# EAGLE schematic Doormio (EAGLE 8.4.0)
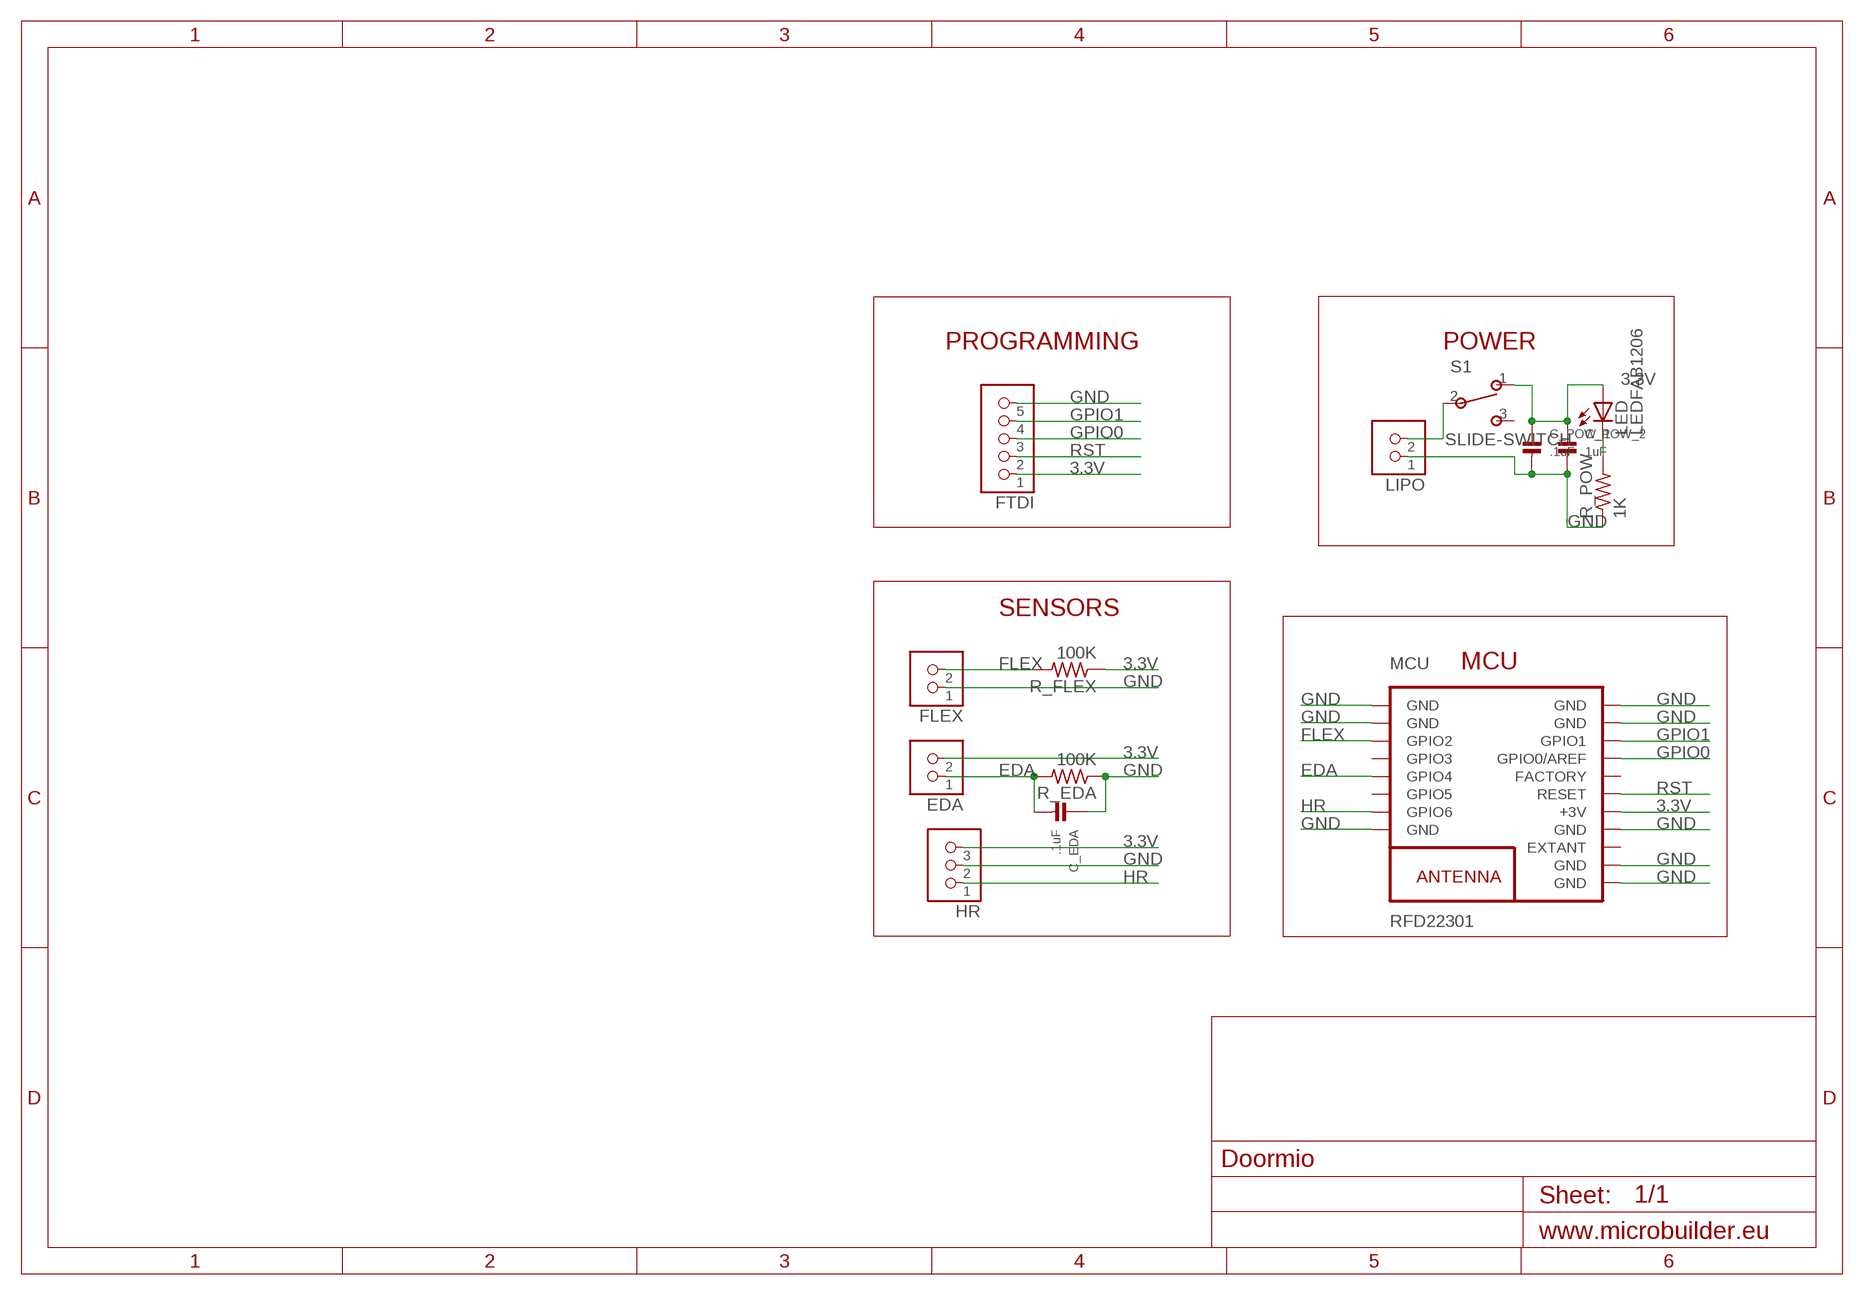
[diagram p0: schematic, sheet 1]

## Parts
C_EDA  .1uF  CAP_CERAMIC0603  [0603]
C_POW_1  .1uF  CAP_CERAMIC0603  [0603]
C_POW_2  1uF  CAP_CERAMIC0603  [0603]
EDA  1X2-SMD-HEADER  [1X02SMD]
FLEX  1X2-SMD-HEADER  [1X02SMD]
FTDI  1X5-SMD-HEADER  [1X05SMD]
HR  1X3-SMD-HEADER  [1X03SMD]
LED  LEDFAB1206  [LED1206FAB]
LIPO  1X2-SMD-HEADER  [1X02SMD]
MCU  RFD22301  [RFD22301]
R_EDA  100K  R-US_R0603  [R0603]
R_FLEX  100K  R-US_R0603  [R0603]
R_POW  1K  R-US_R0603  [R0603]
S1  SLIDE-SWITCH  [AYZ0102AGRLC]

## Nets
3.3V: C_POW_1.1 C_POW_2.1 EDA.VCC FTDI.1 HR.3 LED.1(A) MCU.13(+3V) R_FLEX.1 S1.1
EDA: C_EDA.2 EDA.GND MCU.5(GPIO4) R_EDA.2
FLEX: FLEX.VCC MCU.3(GPIO2) R_FLEX.2
GND: C_EDA.1 C_POW_1.2 C_POW_2.2 FLEX.GND FTDI.5 HR.2 LIPO.GND MCU.1(GND) MCU.2(GND) MCU.8(GND) MCU.9(GND) MCU.10(GND) MCU.12(GND) MCU.18(GND) MCU.19(GND) R_EDA.1 R_POW.1
GPIO0: FTDI.3 MCU.16(GPIO0/AREF)
GPIO1: FTDI.4 MCU.17(GPIO1)
HR: HR.1 MCU.7(GPIO6)
LED_RES: LED.2(C) R_POW.2
RST: FTDI.2 MCU.14(RESET)
VIN: LIPO.VCC S1.2
Unconnected: MCU.4(GPIO3) MCU.6(GPIO5) MCU.11(EXTANT) MCU.15(FACTORY) S1.3

## Notes on the sheet
- PROGRAMMING | POWER
- SENSORS
- MCU

## Library data of the parts
C_EDA C_POW_1 C_POW_2 = microbuilder:CAP_CERAMIC: Ceramic Capacitors 0402 - 0402 Surface Mount Capacitors 16pF 50V 5% [Digikey: 445-4899-2-ND] 18pF 50V 5% [Digikey: 490-1281-2-ND] 22pF 50V 5% [Digikey: 490-1283-2-ND] 68pF 50V 5% [Digikey: 490-1289-2-ND] 0.1uF 10V 10% [Digikey: 490-1318-2-ND] 1.0uF 6.3V 10% [Digikey: 490-1320-2-ND] 0603 - 0603 Surface Mount Capacitors 16 pF 50V 5% [Digikey: 445-5051-2-ND] 22 pF 50V [Digikey: PCC220ACVTR-ND] 33 pF 50V 5% [Digikey: 490-1415-1-ND] 56pF 50V 5% [Digikey: 490-1421-1-ND] 220pF 50V 5% [Digikey: 445-1285-1-ND] 680 pF 50V 2200 pF 50V 5% C0G [Digikey: 445-1297-1-ND] 5600 pF 100V 5% X7R [Digikey: 478-3711-1-ND] 0.1 µF 25V 10% [Digikey: PCC2277TR-ND] 0.22 µF 16V 10% X7R [Digikey: 445-1318-1-ND] 1.0 µF 25V 10% [Digikey: 445-5146-2-ND] 0603 - RF Specific 3pF 250V +/-0.1pF RF [Digikey: 712-1347-1-ND] 18 pF 250V 5% [Digikey: 478-3505-1-ND or 712-1322-1-ND] 56 pF 250V 5% C0G RF [Digikey: 490-4867-1-ND] 68 pF 250V RF [Digikey: 490-4868-1-ND] 0805 - 0805 Surface Mount Capacitors 220 pF 250V 2% RF Ceramic Capacitor [Digikey: 712-1398-1-ND] 1000 pF 50V 2% NP0 Ceramic Capacitor [Digikey: 478-3760-1-ND] 0.1 µF 25V 10% Ceramic Capacitor [Digikey: PCC1828TR-ND] 1.0 µF 16V 10% Ceramic Capacitor[Digikey: 490-1691-2-ND] 10.0 µF 10V 10% Ceramic Capacitor[Digikey: 709-1228-1-ND] 10.0 uF 16V 10% Ceramic Capacitor [Digikey: 478-5165-2-ND] 47 uF 6.3V 20% Ceramic Capacitor [Digikey: 587-1779-1-ND or 399-5506-1-ND] 1206 - 1206 Surface Mount Capacitors 47uF 10V 20% Ceramic Capacitor [Digikey: 490-5528-1-ND or 399-5508-1-ND or 445-6010-1-ND] 100uF 6.3V -20%, +80% Y5V Ceramic Capacitor (Digikey: 490-4512-1-ND, Mouser: 81-GRM31CF50J107ZE1L)
EDA FLEX LIPO = fab:1X2-SMD-HEADER
FTDI = fab:1X5-SMD-HEADER
HR = fab:1X3-SMD-HEADER
LED = fab:LED: LED
MCU = RF_Digital_RFD22301_Eagle_Schematic_PCB_Library:RFD22301: RFD22301 RFduino SMT Module RFD22301 Datasheet: http://www.rfdigital.com/wp-content/uploads/2014/03/RFD22301.Data_.Sheet_.11.24.13_11.38PM.pdf
R_EDA R_FLEX R_POW = resistor:R-US_: RESISTOR, American symbol
S1 = fab:SLIDE-SWITCH: SMD slide-switch AYZ0102AGRLC as found in the fablab inventory. Includes the mounting holes. Made by Zaerc.